# Altium schematic sheet keyboard.SchDoc: Keypad
size A4; DrawnBy: AJ; Engineer: AJ; DocumentNumber: 1; SheetNumber: 1; SheetTotal: 1; Description: Keypad for the user interface
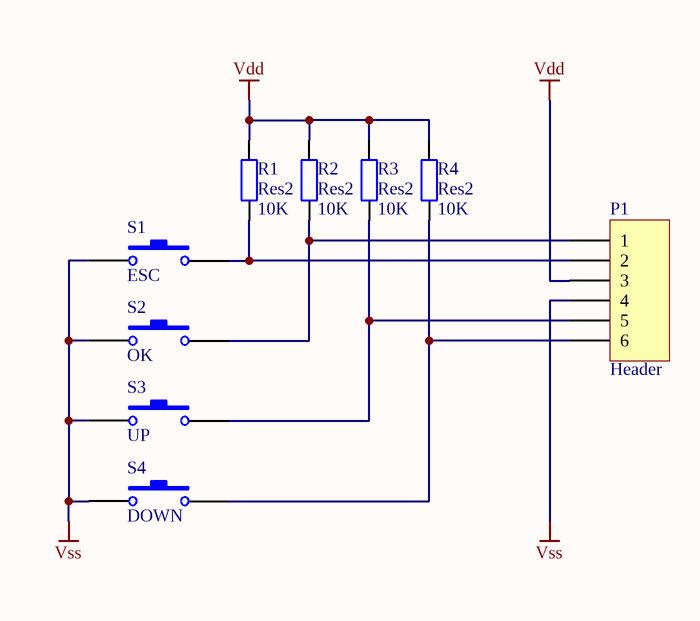
[diagram p0: keyboard.SchDoc]

## Parts
P1  Header  [HDR1X6]
R1  Res2  value 10K  [0805]
R2  Res2  value 10K  [0805]
R3  Res2  value 10K  [0805]
R4  Res2  value 10K  [0805]
S1  ESC  [Switch]
S2  OK  [Switch]
S3  UP  [Switch]
S4  DOWN  [Switch]

## Nets
Vdd: P1.3 R1.2 R2.2 R3.2 R4.2
Vss: P1.4 S1.1 S2.1 S3.1 S4.1
NetP1_1: P1.1 R2.1 S2.2
NetP1_2: P1.2 R1.1 S1.2
NetP1_5: P1.5 R3.1 S3.2
NetP1_6: P1.6 R4.1 S4.2

## Notes on the sheet
- TITLE
- DESCRIPTION
- SHEET
- of
- ENGINEER
- DATE
- REVISION
- AUTHOR
- FILE

## Library data of the parts
P1 = Header 6: Header, 6-Pin; LatestRevisionDate: 17-Jul-2002; LatestRevisionNote: Re-released for DXP Platform.; Publisher: Altium Limited
R1-R4 = Res2: Resistor; Published: 8-Jun-2000; LatestRevisionDate: 17-Jul-2002; LatestRevisionNote: Re-released for DXP Platform.; PackageReference: AXIAL-0.4; Publisher: Altium Limited
S1-S4 = SW-PB: Switch; Published: 24-Mar-1999; LatestRevisionDate: 17-Jul-2002; LatestRevisionNote: Re-released for DXP Platform.; PackageReference: SPST-2; Publisher: Altium Limited